# EAGLE design Sensor Acquisition Board Rev4 (EAGLE 9.6.2)
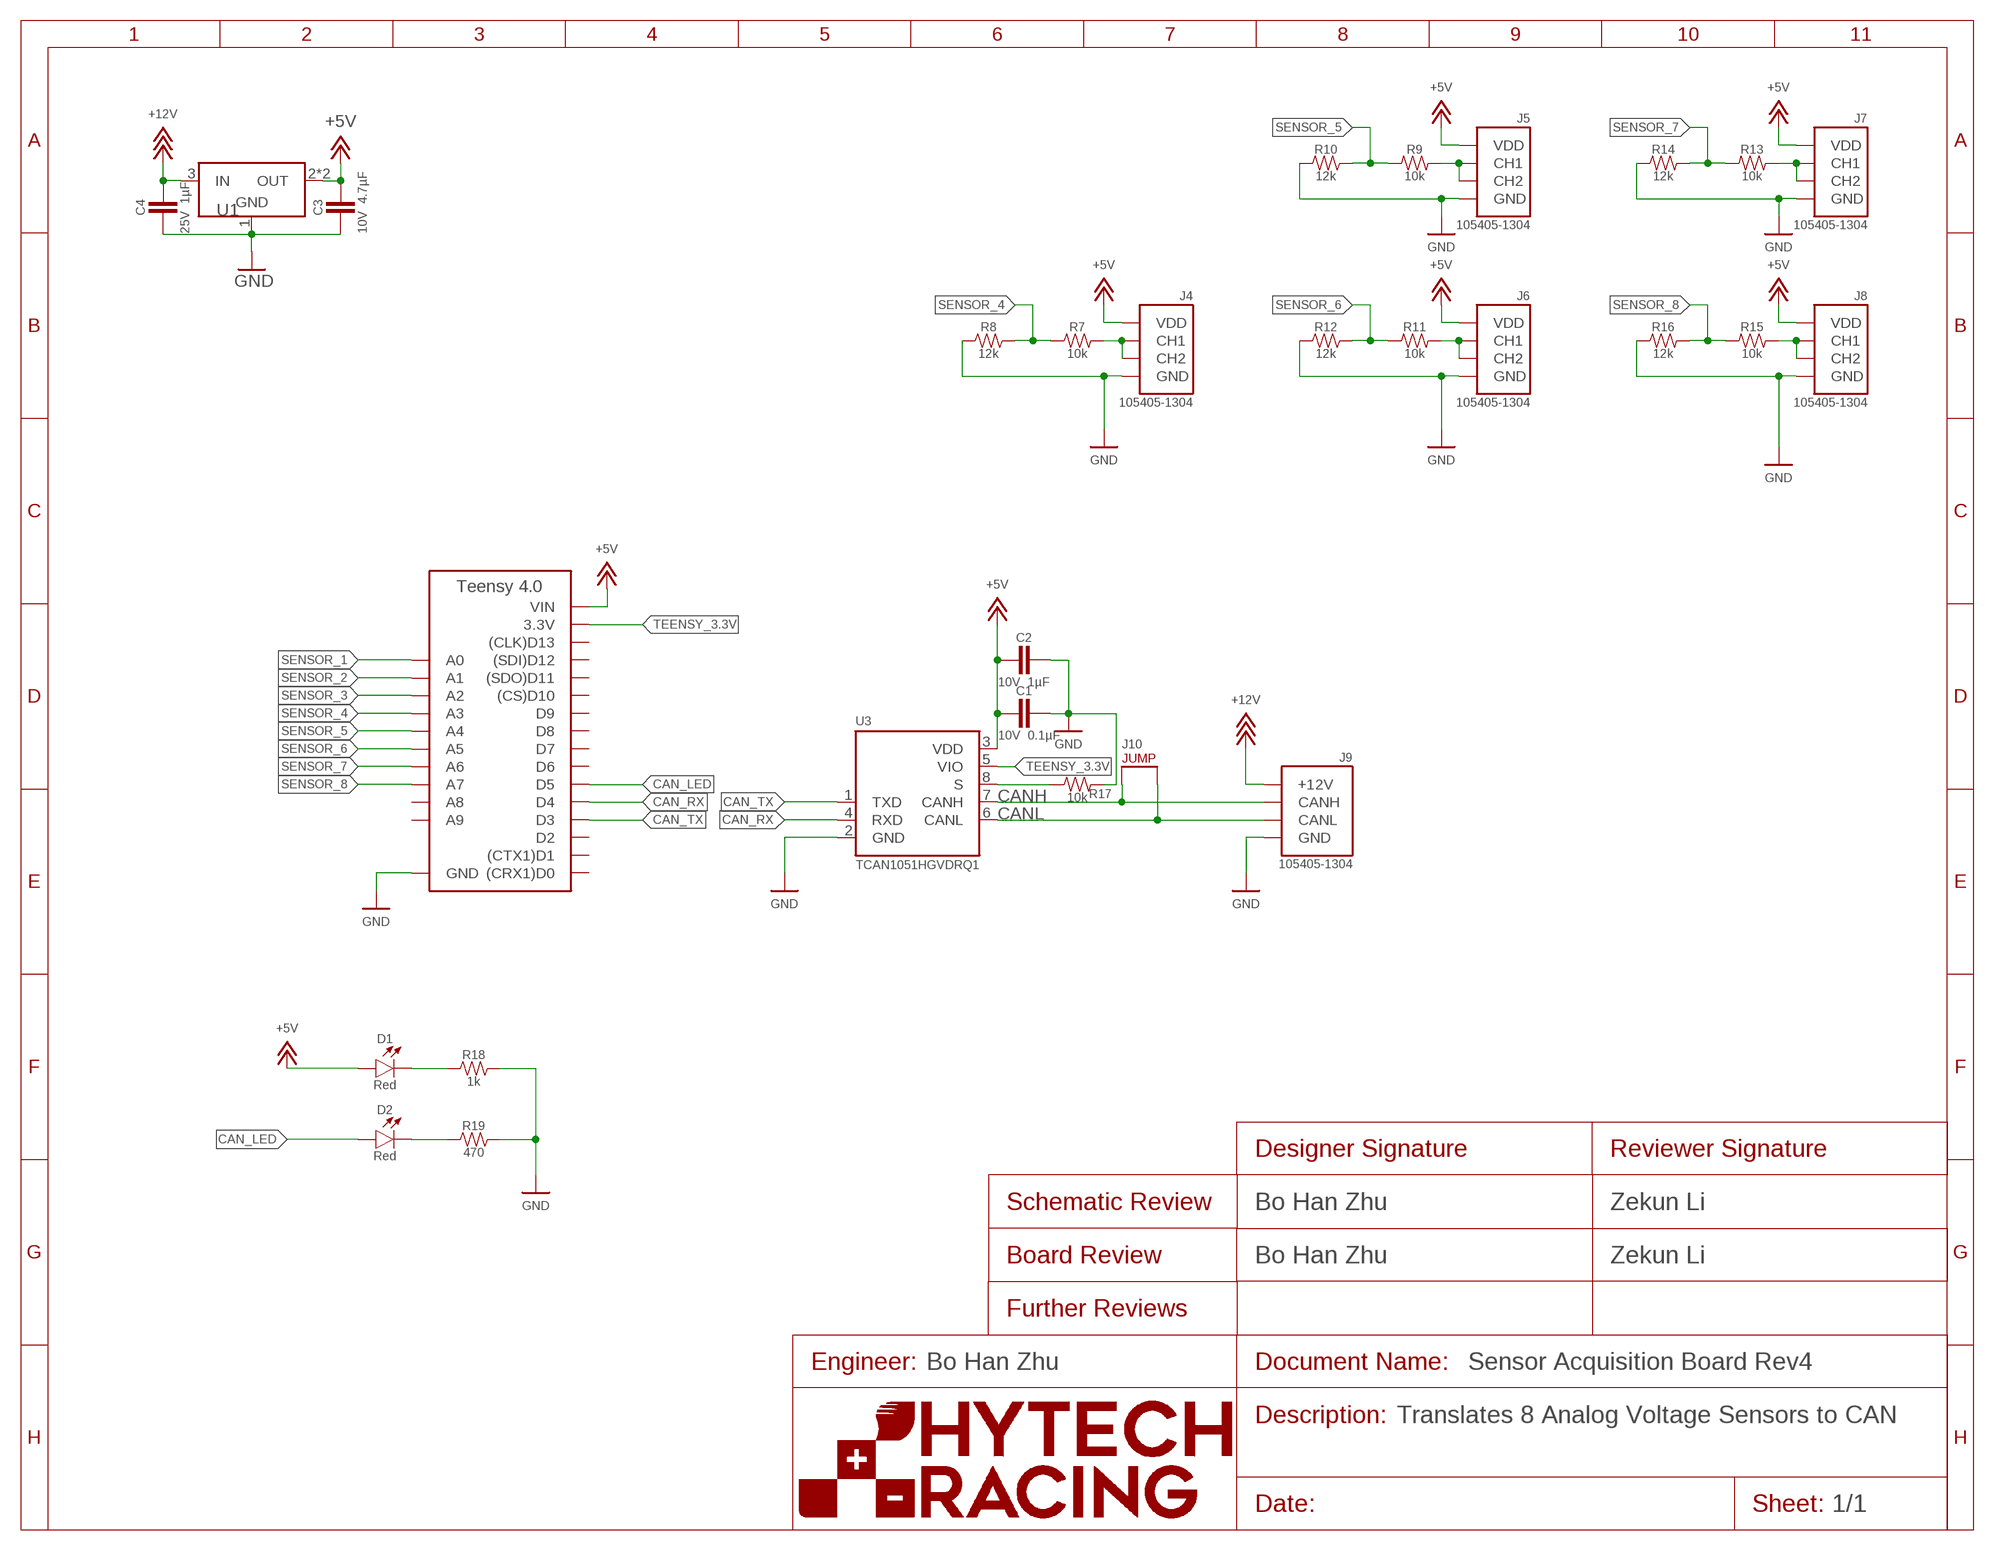
[diagram p0: schematic, sheet 1]
FRAME1 (FRAME): DESCRIPTION_1: Translates 8 Analog Voltage Sensors to CAN; DESIGNER_BOARD: Bo Han Zhu; DESIGNER_SCHEMATIC: Bo Han Zhu; ENGINEER: Bo Han Zhu; REVIEWER_BOARD: Zekun Li; REVIEWER_SCHEMATIC: Zekun Li

## Parts
A2  TEENSY_4.0  [TEENSY_SHORT]
C1  CAPACITOR_0603_10V_0.1UF  [0603-CAP]
C2  CAPACITOR_0603_10V_1UF  [0603-CAP]
C3  CAPACITOR_0603_10V_4.7UF  [0603-CAP]
C4  CAPACITOR_0603_25V_1UF  [0603-CAP]
D1  LED_0603_RED  [0603-LED]
D2  LED_0603_RED  [0603-LED]
J4  CONNECTOR-SENSOR_NF_S_RA_BLACK  [MOLEX_NANOFIT_SMD_RIGHTANGLE_04]
J5  CONNECTOR-SENSOR_NF_S_RA_BLACK  [MOLEX_NANOFIT_SMD_RIGHTANGLE_04]
J6  CONNECTOR-SENSOR_NF_S_RA_BLACK  [MOLEX_NANOFIT_SMD_RIGHTANGLE_04]
J7  CONNECTOR-SENSOR_NF_S_RA_BLACK  [MOLEX_NANOFIT_SMD_RIGHTANGLE_04]
J8  CONNECTOR-SENSOR_NF_S_RA_BLACK  [MOLEX_NANOFIT_SMD_RIGHTANGLE_04]
J9  CONNECTOR-CAN_NF_S_RA_BLACK  [MOLEX_NANOFIT_SMD_RIGHTANGLE_04]
J10  JUMPER_0603_  [0603-RES]
R7  RESISTOR_0603_10K  [0603-RES]
R8  RESISTOR_0603_12K  [0603-RES]
R9  RESISTOR_0603_10K  [0603-RES]
R10  RESISTOR_0603_12K  [0603-RES]
R11  RESISTOR_0603_10K  [0603-RES]
R12  RESISTOR_0603_12K  [0603-RES]
R13  RESISTOR_0603_10K  [0603-RES]
R14  RESISTOR_0603_12K  [0603-RES]
R15  RESISTOR_0603_10K  [0603-RES]
R16  RESISTOR_0603_12K  [0603-RES]
R17  RESISTOR_0603_10K  [0603-RES]
R18  RESISTOR_0603_1K  [0603-RES]
R19  RESISTOR_0603_470  [0603-RES]
U1  VOLTAGE_REGULATOR_SOT-223_5V  [SOT-223]
U3  TCAN1051HQV-Q1  [SOIC-08(NARROW,0.15")]

## Nets
+5V: A2.VIN C1.2 C2.2 C3.1 D1.2(A) J4.1(VDD) J5.1(VDD) J6.1(VDD) J7.1(VDD) J8.1(VDD) U1.2(OUT) U1.4(OUT) U3.3(VDD)
+12V: C4.1 J9.1(+12V) U1.3(IN)
CAN_LED: A2.D5 D2.2(A)
CAN_RX: A2.D4 U3.4(RXD)
CAN_TX: A2.D3 U3.1(TXD)
CANH: J9.4(CANH) J10.1 U3.7(CANH)
CANL: J9.3(CANL) J10.2 U3.6(CANL)
GND: A2.AGND/GND(GND) A2.GND C1.1 C2.1 C3.2 C4.2 J4.2(GND) J5.2(GND) J6.2(GND) J7.2(GND) J8.2(GND) J9.2(GND) R8.1 R10.1 R12.1 R14.1 R16.1 R17.2 R18.2 R19.2 U1.1(GND) U3.2(GND)
N$1: D1.1(C) R18.1
N$2: D2.1(C) R19.1
N$3: J8.3(CH1) J8.4(CH2) R15.2
N$4: R17.1 U3.8(S)
N$5: J7.3(CH1) J7.4(CH2) R13.2
N$6: J5.3(CH1) J5.4(CH2) R9.2
N$7: J6.3(CH1) J6.4(CH2) R11.2
N$9: J4.3(CH1) J4.4(CH2) R7.2
SENSOR_1: A2.D14(A0)
SENSOR_2: A2.D15(A1)
SENSOR_3: A2.D16(A2)
SENSOR_4: A2.D17(A3) R7.1 R8.2
SENSOR_5: A2.D18(A4) R9.1 R10.2
SENSOR_6: A2.D19(A5) R11.1 R12.2
SENSOR_7: A2.D20(A6) R13.1 R14.2
SENSOR_8: A2.D21(A7) R15.1 R16.2
TEENSY_3.3V: A2.3.3V U3.5(VIO)
Unconnected: A2.D0((CRX1)D0) A2.D1((CTX1)D1) A2.D2 A2.D6 A2.D7 A2.D8 A2.D9 A2.D10((CS)D10) A2.D11((SDO)D11) A2.D12((SDI)D12) A2.D13((CLK)D13) A2.D22(A8) A2.D23(A9)

## Library data of the parts
A2 = HyTechDevices:TEENSY_4.0: Teensy 4.0 Datasheet <https://www.pjrc.com/store/teensy40.html> Requires ordering of: 2: 14 pin, 0.1" pitch female headers; TEENSY: 4.0
C1 = HyTechDevices:CAPACITOR_?_*: Capacitor, Non-Polarized VJ...1BC Series Datasheet <https://www.mouser.com/datasheet/2/427/vjw1bcbascomseries-1762447.pdf> Samsung Datasheet <https://www.mouser.com/datasheet/2/585/MLCC-1837944.pdf> Walsin Datasheet <https://www.mouser.com/datasheet/2/210/WTC_MLCC_General_Purpose-1534899.pdf> GRM188R61A226ME15D <https://www.mouser.com/datasheet/2/281/1/GRM188R61A226ME15_02A-1985787.pdf> GRM188R61E106MA73D <https://www.mouser.com/datasheet/2/281/1/GRM188R61E106MA73_01A-1985806.pdf> 885012006013 <https://www.mouser.com/datasheet/2/445/885012006013-1726946.pdf> 2220Y6300105KXTWS2 <https://www.mouser.com/datasheet/2/218/SMD_High_and_Std_StackiCap_P62-1825512.pdf> Yageo Class 2, X5R <https://www.mouser.com/datasheet/2/447/UPY_GPHC_X5R_4V_to_50V_26-1827097.pdf> TDK C Series <https://www.mouser.com/ProductDetail/TDK/C3216X5R1V226M160AC?qs=%2Fha2pyFadujbcx9jh7lYl%2F4NeMoXFhdc8AqVWNq4wW6M2y7zl6GzBuhgtI0ngznN> AVX Automotive MLCC <https://www.mouser.com/datasheet/2/40/AutoMLCC-777028.pdf> KEMET X7R Series <https://www.mouser.com/datasheet/2/212/KEM_C1002_X7R_SMD-1102033.pdf> Kyocera AVX <https://www.mouser.com/datasheet/2/40/C0GNP0_Dielectric-951274.pdf>; CAPACITANCE: 0.1µF; DKPN: 720-1688-1-ND; MANUFACTURER: Vishay Vitramon; MOPN: 77-VJ0603Y104JXQPBC; MPN: VJ0603Y104JXQPW1BC; TOLERANCE: 5%; VOLTAGE: 10V
C2 = HyTechDevices:CAPACITOR_?_*: Capacitor, Non-Polarized VJ...1BC Series Datasheet <https://www.mouser.com/datasheet/2/427/vjw1bcbascomseries-1762447.pdf> Samsung Datasheet <https://www.mouser.com/datasheet/2/585/MLCC-1837944.pdf> Walsin Datasheet <https://www.mouser.com/datasheet/2/210/WTC_MLCC_General_Purpose-1534899.pdf> GRM188R61A226ME15D <https://www.mouser.com/datasheet/2/281/1/GRM188R61A226ME15_02A-1985787.pdf> GRM188R61E106MA73D <https://www.mouser.com/datasheet/2/281/1/GRM188R61E106MA73_01A-1985806.pdf> 885012006013 <https://www.mouser.com/datasheet/2/445/885012006013-1726946.pdf> 2220Y6300105KXTWS2 <https://www.mouser.com/datasheet/2/218/SMD_High_and_Std_StackiCap_P62-1825512.pdf> Yageo Class 2, X5R <https://www.mouser.com/datasheet/2/447/UPY_GPHC_X5R_4V_to_50V_26-1827097.pdf> TDK C Series <https://www.mouser.com/ProductDetail/TDK/C3216X5R1V226M160AC?qs=%2Fha2pyFadujbcx9jh7lYl%2F4NeMoXFhdc8AqVWNq4wW6M2y7zl6GzBuhgtI0ngznN> AVX Automotive MLCC <https://www.mouser.com/datasheet/2/40/AutoMLCC-777028.pdf> KEMET X7R Series <https://www.mouser.com/datasheet/2/212/KEM_C1002_X7R_SMD-1102033.pdf> Kyocera AVX <https://www.mouser.com/datasheet/2/40/C0GNP0_Dielectric-951274.pdf>; CAPACITANCE: 1µF; DKPN: 311-1796-1-ND; MANUFACTURER: Yageo; MOPN: 603-CC603KRX7R6BB105; MPN: CC0603KRX7R6BB105; TOLERANCE: 10%; VOLTAGE: 10V
C3 = HyTechDevices:CAPACITOR_?_*: Capacitor, Non-Polarized VJ...1BC Series Datasheet <https://www.mouser.com/datasheet/2/427/vjw1bcbascomseries-1762447.pdf> Samsung Datasheet <https://www.mouser.com/datasheet/2/585/MLCC-1837944.pdf> Walsin Datasheet <https://www.mouser.com/datasheet/2/210/WTC_MLCC_General_Purpose-1534899.pdf> GRM188R61A226ME15D <https://www.mouser.com/datasheet/2/281/1/GRM188R61A226ME15_02A-1985787.pdf> GRM188R61E106MA73D <https://www.mouser.com/datasheet/2/281/1/GRM188R61E106MA73_01A-1985806.pdf> 885012006013 <https://www.mouser.com/datasheet/2/445/885012006013-1726946.pdf> 2220Y6300105KXTWS2 <https://www.mouser.com/datasheet/2/218/SMD_High_and_Std_StackiCap_P62-1825512.pdf> Yageo Class 2, X5R <https://www.mouser.com/datasheet/2/447/UPY_GPHC_X5R_4V_to_50V_26-1827097.pdf> TDK C Series <https://www.mouser.com/ProductDetail/TDK/C3216X5R1V226M160AC?qs=%2Fha2pyFadujbcx9jh7lYl%2F4NeMoXFhdc8AqVWNq4wW6M2y7zl6GzBuhgtI0ngznN> AVX Automotive MLCC <https://www.mouser.com/datasheet/2/40/AutoMLCC-777028.pdf> KEMET X7R Series <https://www.mouser.com/datasheet/2/212/KEM_C1002_X7R_SMD-1102033.pdf> Kyocera AVX <https://www.mouser.com/datasheet/2/40/C0GNP0_Dielectric-951274.pdf>; CAPACITANCE: 4.7µF; DKPN: 1276-1044-1-ND; MANUFACTURER: Samsung Electro-Mechanics; MOPN: 187-CL10A475KP8NNNC; MPN: CL10A475KP8NNNC; TOLERANCE: 10%; VOLTAGE: 10V
C4 = HyTechDevices:CAPACITOR_?_*: Capacitor, Non-Polarized VJ...1BC Series Datasheet <https://www.mouser.com/datasheet/2/427/vjw1bcbascomseries-1762447.pdf> Samsung Datasheet <https://www.mouser.com/datasheet/2/585/MLCC-1837944.pdf> Walsin Datasheet <https://www.mouser.com/datasheet/2/210/WTC_MLCC_General_Purpose-1534899.pdf> GRM188R61A226ME15D <https://www.mouser.com/datasheet/2/281/1/GRM188R61A226ME15_02A-1985787.pdf> GRM188R61E106MA73D <https://www.mouser.com/datasheet/2/281/1/GRM188R61E106MA73_01A-1985806.pdf> 885012006013 <https://www.mouser.com/datasheet/2/445/885012006013-1726946.pdf> 2220Y6300105KXTWS2 <https://www.mouser.com/datasheet/2/218/SMD_High_and_Std_StackiCap_P62-1825512.pdf> Yageo Class 2, X5R <https://www.mouser.com/datasheet/2/447/UPY_GPHC_X5R_4V_to_50V_26-1827097.pdf> TDK C Series <https://www.mouser.com/ProductDetail/TDK/C3216X5R1V226M160AC?qs=%2Fha2pyFadujbcx9jh7lYl%2F4NeMoXFhdc8AqVWNq4wW6M2y7zl6GzBuhgtI0ngznN> AVX Automotive MLCC <https://www.mouser.com/datasheet/2/40/AutoMLCC-777028.pdf> KEMET X7R Series <https://www.mouser.com/datasheet/2/212/KEM_C1002_X7R_SMD-1102033.pdf> Kyocera AVX <https://www.mouser.com/datasheet/2/40/C0GNP0_Dielectric-951274.pdf>; CAPACITANCE: 1µF; DKPN: 1276-1184-1-ND; MANUFACTURER: Samsung Electro-Mechanics; MOPN: 187-CL10B105KA8NNNC; MPN: CL10B105KA8NNNC; TOLERANCE: 10%; VOLTAGE: 25V
D1 D2 = HyTechDevices:LED_?_*: LED 0603 Blue <https://www.mouser.com/datasheet/2/216/APT1608VBC_D-246010.pdf> Green <https://www.mouser.com/datasheet/2/216/APT1608ZGCK-1173388.pdf> Orange <https://www.mouser.com/datasheet/2/216/APT1608SECK-6197.pdf> Red <https://www.mouser.com/datasheet/2/216/APT1608SECK-J3-PRV-1173336.pdf> White <https://www.mouser.com/datasheet/2/50/SM0603UWC-880813.pdf> Yellow <https://www.mouser.com/datasheet/2/216/APT1608SYCK-J3-PRV-1173311.pdf> 2835 (Series not on Digikey) Lumiled LUXEON 2835 Color Line <https://www.mouser.com/datasheet/2/602/DS236_luxeon_2835_color_line_datasheet-1596094.pdf>; COLOR: Red; DKPN: 754-1786-1-ND; MANUFACTURER: Kingbright; MOPN: 604-APT1608SECKJ3PRV; MPN: APT1608SECK/J3-PRV
J4-J8 = HyTechDevices:CONNECTOR-SENSOR_?_*: HyTech Sensor Connector; DKPN: 1054051304-ND; MANUFACTURER: Molex; MOPN: 538-105405-1304; MPN: 105405-1304
J9 = HyTechDevices:CONNECTOR-CAN_?_*: HyTech CAN Connector; DKPN: 1054051304-ND; MANUFACTURER: Molex; MOPN: 538-105405-1304; MPN: 105405-1304
J10 = HyTechDevices:JUMPER_?_*: 2 Pin Connector; DKPN: 13-RC0603FR-130RLTR-ND; MANUFACTURER: YAGEO; MOPN: 603-RC0603FR-130RL; MPN: RC0603FR-130RL
R7 R9 R11 R13 R15 R17 = HyTechDevices:RESISTOR_?_*: Resistor PWR163 Series <https://www.mouser.com/datasheet/2/54/pwr163-777985.pdf> AC Series <https://www.mouser.com/datasheet/2/447/Yageo_PYu_AC_51_RoHS_L_7_1714230-1874691.pdf> PU Series <https://www.mouser.com/datasheet/2/447/PYu-PU_51_RoHS_L_6-1504619.pdf> ERA Series <https://www.mouser.com/datasheet/2/315/AOA0000C307-1149632.pdf> PWR263 Series <https://www.mouser.com/datasheet/2/54/pwr263s_35-778069.pdf> RC Series <https://www.mouser.com/datasheet/2/447/Yageo_03_18_2021_PYu_RC_Group_51_RoHS_L_11-2199992.pdf> ERJ PB3, PB6 Series <https://www.mouser.com/datasheet/2/315/AOA0000C328-1530132.pdf> ERJ PA2, P03, PA3, P06, P08, P14 Series <https://www.mouser.com/datasheet/2/315/AOA0000C331-1141874.pdf>; DKPN: 311-10.0KHRCT-ND; MANUFACTURER: Yageo; MOPN: 603-RC0603FR-0710KL; MPN: RC0603FR-0710KL; POWER: 0.1W; RESISTANCE: 10k; TOLERANCE: 1%; VOLTAGE_CONTINUOUS: 31.62V; VOLTAGE_MAX: 75V
R8 R10 R12 R14 R16 = HyTechDevices:RESISTOR_?_*: Resistor PWR163 Series <https://www.mouser.com/datasheet/2/54/pwr163-777985.pdf> AC Series <https://www.mouser.com/datasheet/2/447/Yageo_PYu_AC_51_RoHS_L_7_1714230-1874691.pdf> PU Series <https://www.mouser.com/datasheet/2/447/PYu-PU_51_RoHS_L_6-1504619.pdf> ERA Series <https://www.mouser.com/datasheet/2/315/AOA0000C307-1149632.pdf> PWR263 Series <https://www.mouser.com/datasheet/2/54/pwr263s_35-778069.pdf> RC Series <https://www.mouser.com/datasheet/2/447/Yageo_03_18_2021_PYu_RC_Group_51_RoHS_L_11-2199992.pdf> ERJ PB3, PB6 Series <https://www.mouser.com/datasheet/2/315/AOA0000C328-1530132.pdf> ERJ PA2, P03, PA3, P06, P08, P14 Series <https://www.mouser.com/datasheet/2/315/AOA0000C331-1141874.pdf>; DKPN: 311-12.0KHRCT-ND; MANUFACTURER: Yageo; MOPN: 603-RC0603FR-0712KL; MPN: RC0603FR-0712KL; POWER: 0.1W; RESISTANCE: 12k; TOLERANCE: 1%; VOLTAGE_CONTINUOUS: 34.64V; VOLTAGE_MAX: 75V
R18 = HyTechDevices:RESISTOR_?_*: Resistor PWR163 Series <https://www.mouser.com/datasheet/2/54/pwr163-777985.pdf> AC Series <https://www.mouser.com/datasheet/2/447/Yageo_PYu_AC_51_RoHS_L_7_1714230-1874691.pdf> PU Series <https://www.mouser.com/datasheet/2/447/PYu-PU_51_RoHS_L_6-1504619.pdf> ERA Series <https://www.mouser.com/datasheet/2/315/AOA0000C307-1149632.pdf> PWR263 Series <https://www.mouser.com/datasheet/2/54/pwr263s_35-778069.pdf> RC Series <https://www.mouser.com/datasheet/2/447/Yageo_03_18_2021_PYu_RC_Group_51_RoHS_L_11-2199992.pdf> ERJ PB3, PB6 Series <https://www.mouser.com/datasheet/2/315/AOA0000C328-1530132.pdf> ERJ PA2, P03, PA3, P06, P08, P14 Series <https://www.mouser.com/datasheet/2/315/AOA0000C331-1141874.pdf>; DKPN: 311-1.00KHRCT-ND; MANUFACTURER: Yageo; MOPN: 603-RC0603FR-071KL; MPN: RC0603FR-071KL; POWER: 0.1W; RESISTANCE: 1k; TOLERANCE: 1%; VOLTAGE_CONTINUOUS: 10.00V; VOLTAGE_MAX: 75V
R19 = HyTechDevices:RESISTOR_?_*: Resistor PWR163 Series <https://www.mouser.com/datasheet/2/54/pwr163-777985.pdf> AC Series <https://www.mouser.com/datasheet/2/447/Yageo_PYu_AC_51_RoHS_L_7_1714230-1874691.pdf> PU Series <https://www.mouser.com/datasheet/2/447/PYu-PU_51_RoHS_L_6-1504619.pdf> ERA Series <https://www.mouser.com/datasheet/2/315/AOA0000C307-1149632.pdf> PWR263 Series <https://www.mouser.com/datasheet/2/54/pwr263s_35-778069.pdf> RC Series <https://www.mouser.com/datasheet/2/447/Yageo_03_18_2021_PYu_RC_Group_51_RoHS_L_11-2199992.pdf> ERJ PB3, PB6 Series <https://www.mouser.com/datasheet/2/315/AOA0000C328-1530132.pdf> ERJ PA2, P03, PA3, P06, P08, P14 Series <https://www.mouser.com/datasheet/2/315/AOA0000C331-1141874.pdf>; DKPN: P470BYCT-ND; MANUFACTURER: Panasonic Electronic Components; MOPN: 667-ERJ-PA3F4700V; MPN: ERJ-PA3F4700V; POWER: 0.25W; RESISTANCE: 470; TOLERANCE: 1%; VOLTAGE_CONTINUOUS: 10.84V; VOLTAGE_MAX: 150V
U1 = HyTechDevices:VOLTAGE_REGULATOR_?_*: Voltage Regulators LDL1117S50R Datasheet <https://www.mouser.com/datasheet/2/389/dm00366442-1799212.pdf> NCP785AH120T1G <https://www.mouser.com/datasheet/2/308/NCP785A_D-1812704.pdf> LMS8117A Datasheet <https://www.ti.com/lit/ds/symlink/lms8117a.pdf?HQS>; DKPN: 497-17240-1-ND; MANUFACTURER: STMicroelectronics; MOPN: 511-LDL1117S50R; MPN: LDL1117S50R
U3 = HyTechDevices:TCAN1051*V-Q1: TCAN1051*V Can Tranciever Datasheet <https://www.ti.com/lit/ds/symlink/tcan1051hgv-q1.pdf?HQS=dis-mous-null-mousermode-dsf-pf-null-wwe&ts=1610765132518&ref_url=https%253A%252F%252Fwww.mouser.com%252Ff>; DKPN: 296-49935-1-ND; MANUFACTURER: Texas Instruments; MOPN: 595-TCAN1051HGVDQ1; MPN: TCAN1051HGVDRQ1

## Board
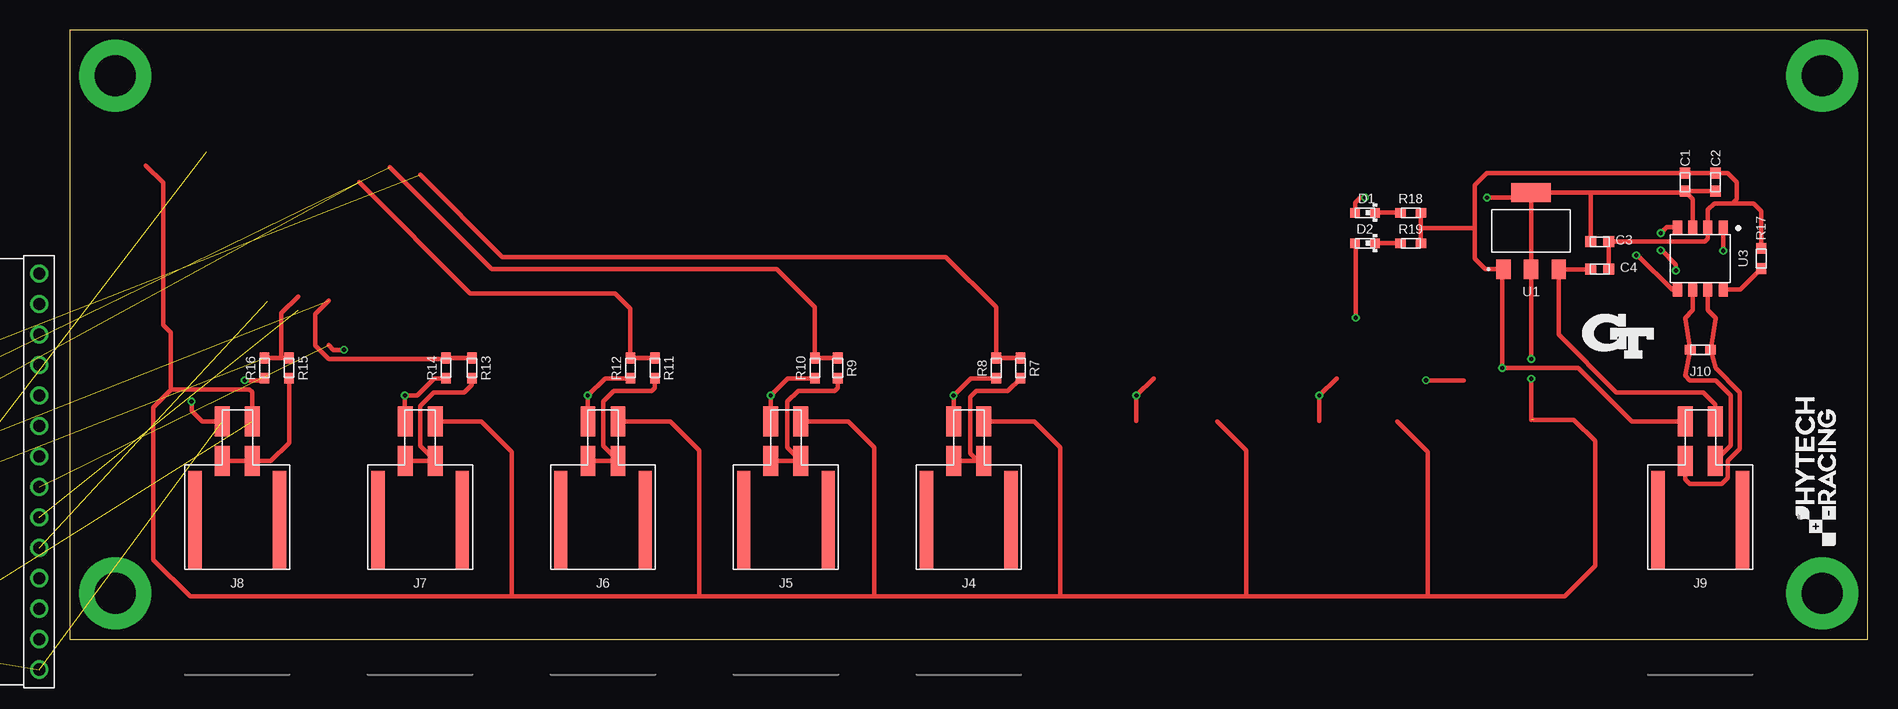
[diagram p1: board, top side]
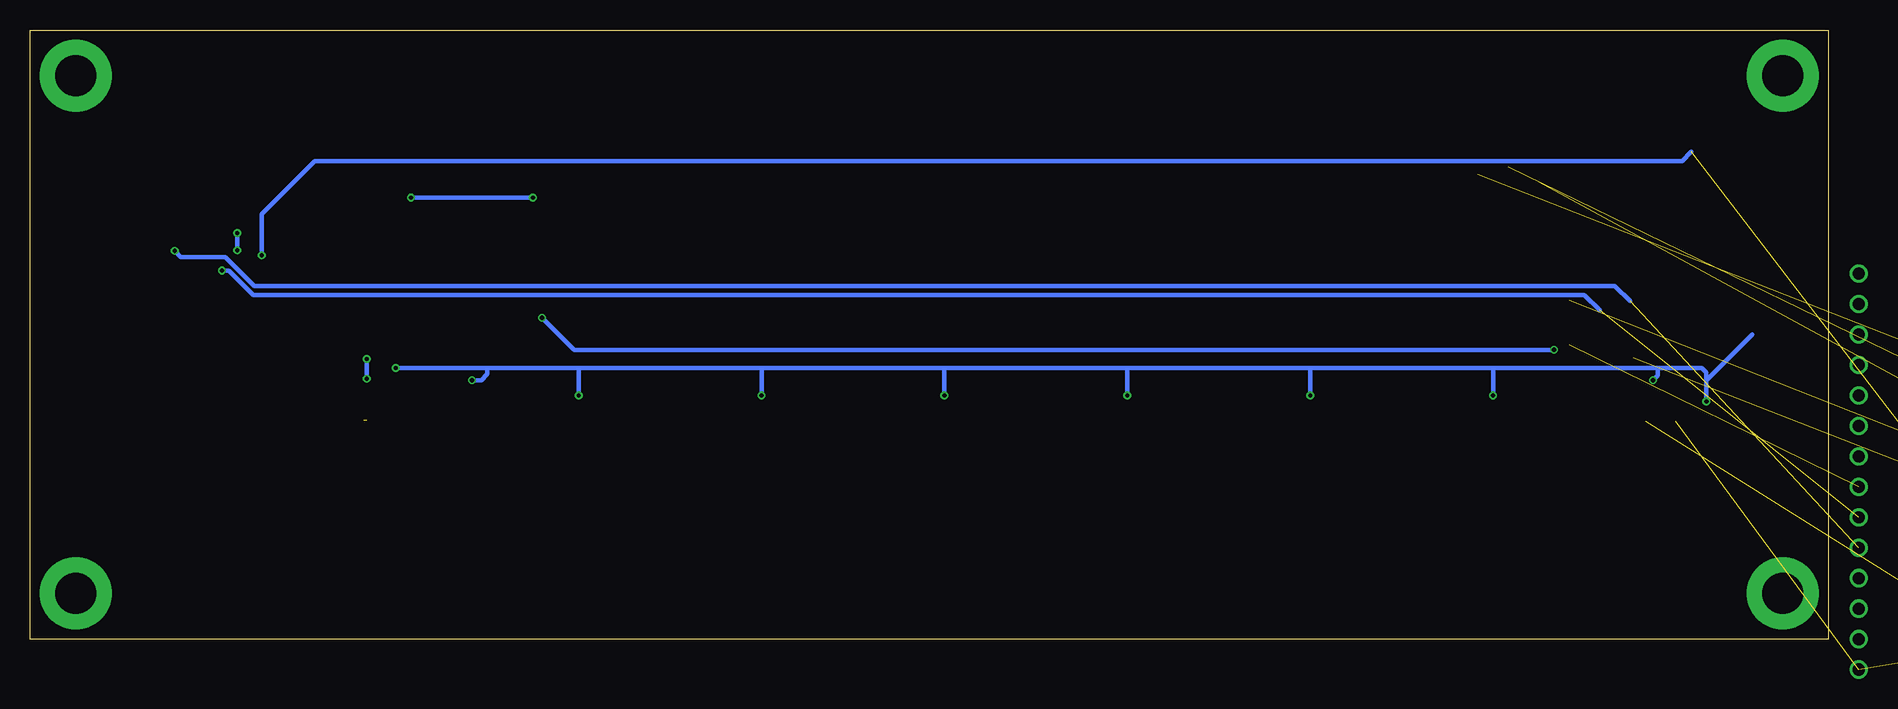
[diagram p2: board, bottom side, seen from below]

Size 149.86 x 50.8 mm. Coordinates in mm from the lower left corner, seen from the top.
Outline: 0,0 149.86,0 149.86,50.8 0,50.8 0,0
Copper layers (1*16): Top 0.035mm / dielectric 1.53mm / Bottom 0.035mm
Design rules "JLCPCB (2 Layer)": minimum track width 5mil, minimum drill 0.3mm, track to track 5mil, track to pad 5mil, pad to pad 5mil, via to via 20mil, smd to smd 5mil, copper to edge 0.2mm, drill to drill 21mil, minimum pad ring 6mil, minimum via ring 6mil, stop-mask expansion 6mil, vias tented up to drill 30mil, thermal gap 10mil

### Footprints (pad centres in the part's own frame; a part is rotated, then mirrored left to right if it is on the bottom)
TEENSY_SHORT = drill 1.016: 3.3V 0,5.08; AGND/GND 0,2.54; D0 15.24,2.54; D1 15.24,5.08; D2 15.24,7.62; D3 15.24,10.16; D4 15.24,12.7; D5 15.24,15.24; D6 15.24,17.78; D7 15.24,20.32; D8 15.24,22.86; D9 15.24,25.4; D10 15.24,27.94; D11 15.24,30.48; D12 15.24,33.02; D13 0,33.02; D14 0,30.48; D15 0,27.94; D16 0,25.4; D17 0,22.86; D18 0,20.32; D19 0,17.78; D20 0,15.24; D21 0,12.7; D22 0,10.16; D23 0,7.62; GND 15.24,0; VIN 0,0
0603-CAP = smd 0.9 x 0.9: 1 -0.75,0; 2 0.75,0
0603-LED = smd 0.8 x 0.8: 1 -0.825,0; 2 0.825,0
MOLEX_NANOFIT_SMD_RIGHTANGLE_04 = smd 1.24 x 2.5: 1 1.25,1.65; 2 -1.25,1.65; 3 1.25,-1.65; 4 -1.25,-1.65 | smd 1.1 x 8.2: PAD1 -3.52,-6.58; PAD2 3.52,-6.58
0603-RES = smd 0.9 x 0.8: 1 -0.85,0; 2 0.85,0
SOT-223 = smd 1.2 x 1.6: 1 -2.3,-3.2; 2 0,-3.2; 3 2.3,-3.2 | smd 3.3 x 1.6: 4 0,3.2
SOIC-08(NARROW,0.15") = smd 0.762 x 1.143: 1 -1.905,-2.603; 2 -0.635,-2.603; 3 0.635,-2.603; 4 1.905,-2.603; 5 1.905,2.603; 6 0.635,2.603; 7 -0.635,2.603; 8 -1.905,2.603
MOUNTING_M3 = drill 3.4 pad 6: 1 0,0

### Placement (x,y rotation side)
A2  -17.78,-2.54 0 top
C1  134.62,38.1 270 top
C2  137.16,38.1 270 top
C3  127.51,33.15 0 top
C4  127.51,30.86 0 top
D1  107.95,35.56 180 top
D2  107.95,33.02 180 top
J4  74.93,16.51 0 top
J5  59.69,16.51 0 top
J6  44.45,16.51 0 top
J7  29.21,16.51 0 top
J8  13.97,16.51 0 top
J9  135.89,16.51 0 top
J10  135.89,24.13 180 top
R7  79.25,22.61 270 top
R8  77.22,22.61 90 top
R9  64.01,22.61 270 top
R10  62.1,22.61 90 top
R11  48.77,22.61 270 top
R12  46.74,22.61 90 top
R13  33.53,22.61 270 top
R14  31.37,22.61 90 top
R15  18.29,22.61 270 top
R16  16.26,22.61 90 top
R17  140.97,31.75 90 top
R18  111.76,35.56 0 top
R19  111.76,33.02 0 top
U1  121.79,34.04 0 top
U3  135.89,31.75 180 top
U$1  [MOUNTING_M3]  146.05,3.81 0 top
U$2  [MOUNTING_M3]  3.81,3.81 0 top
U$3  [LOGO_HYTECH_0.5"]  147.32,7.62 90 top
U$4  [MOUNTING_M3]  146.05,46.99 0 top
U$5  [MOUNTING_M3]  3.81,46.99 0 top
U$6  [LOGO_GT_0.25"]  129.03,25.27 0 top

### Tracks (layer width: path | path; a pad name or v marks a point on that pad's centre or on a via)
+5V  (via drill 0.35)  (2 unrouted)
  Top 0.381: C1.2 C2.2 | C1.2 135.25,36.72 U3.3 | J8.1 15.22,20.59 14.99,20.83 8.51,20.83 8.45,20.77 | 36.83,3.56 10.03,3.56 6.99,6.6 6.99,19.3 8.45,20.77 | 36.83,3.56 52.45,3.56 | 52.45,3.56 67.06,3.56 | 67.06,3.56 82.55,3.56 | 82.55,3.56 98.04,3.56 | 98.04,3.56 113.16,3.56 | 113.16,3.56 124.59,3.56 127.13,6.1 127.13,16.51 125.35,18.29 122.03,18.29 | 113.16,3.56 113.16,15.62 110.62,18.16 | 98.04,3.56 98.04,15.75 95.63,18.16 | J4.1 80.39,18.16 82.55,16 82.55,3.56 | J5.1 64.9,18.16 67.06,16 67.06,3.56 | J6.1 50.04,18.16 52.45,15.75 52.45,3.56 | J7.1 34.29,18.16 36.83,15.62 36.83,3.56 | 8.45,20.77 8.45,25.55 7.79,26.21 7.79,38.06 6.35,39.5 | U1.4 126.75,37.24 | 126.75,37.24 134.51,37.24 C1.2 | U1.4 U1.2 v121.79,23.37 | v121.79,21.72 121.79,18.27 | C3.1 126.76,37.22 126.75,37.24 | U1.4 121.39,36.83 v118.11,36.83 | v107.95,36.83 107.57,36.83 107.12,36.39 D1.2
  Bottom 0.381: v121.79,23.37 v121.79,21.72 | v118.11,36.83 v107.95,36.83
+12V
  Top 0.381: J9.1 137.14,19.58 136.14,20.57 128.91,20.57 124.09,25.39 U1.3 126.73,30.84 C4.1
CAN_LED  (via drill 0.35)  (1 unrouted)
  Top 0.381: v107.19,26.8 107.19,32.96 D2.2 | v22.86,24.13 21.97,24.13 21.59,24.51
  Bottom 0.381: v107.19,26.8 104.52,24.13 v22.86,24.13
CAN_RX  (via drill 0.35)  (1 unrouted)
  Top 0.381: v133.86,30.73 133.86,31.24 132.59,32.51 v132.59,32.43 | v132.59,33.87 133.07,34.35 U3.4
  Bottom 0.381: v133.86,30.73 133.31,30.73 131.27,28.7 20.32,28.7 19.05,27.43 | v132.59,32.43 v132.59,33.87
CAN_TX  (via drill 0.35)  (1 unrouted)
  Top 0.381: U3.1 v137.79,32.38
  Bottom 0.381: 16.51,28.19 17.78,29.46 131.19,29.46 133.6,31.88 136.27,31.88 137.29,31.88 v137.79,32.38
CANH
  Top 0.381: J9.4 134.64,13.31 135,12.95 137.67,12.95 138.18,13.46 138.18,14.86 139.19,15.88 139.19,20.57 137.16,22.61 J10.1 137.16,26.8 136.53,27.43 U3.7
CANL
  Top 0.381: J9.3 138.43,16.15 138.43,20.32 137.16,21.59 135,21.59 134.62,21.97 J10.2 134.62,26.8 135.25,27.43 U3.6
GND  (via drill 0.35)  (2 unrouted)
  Top 0.381: 138.56,36.32 137.03,36.32 136.53,35.81 U3.2 136.53,33.4 136.27,33.15 C3.2 C4.2 | 138.56,36.32 138.94,36.7 138.94,38.1 138.19,38.85 C2.1 C1.1 118.1,38.85 117.09,37.85 117.09,34.29 | 138.56,36.32 140.34,36.32 140.97,35.69 R17.2 | J8.2 11.05,18.16 10.16,19.05 v10.16,19.81 | 104.14,18.18 v104.14,20.32 105.58,21.76 | J7.2 27.94,18.18 v27.94,20.32 28.96,20.32 30.39,21.76 R14.1 | J6.2 43.18,18.18 v43.18,20.32 44.62,21.76 R12.1 | J5.2 58.42,18.18 v58.42,20.32 59.86,21.76 R10.1 | J4.2 73.66,18.18 v73.66,20.32 75.1,21.76 R8.1 | 88.9,18.18 v88.9,20.32 90.34,21.76 | v119.38,22.61 125.73,22.61 130.18,18.16 J9.2 | v119.38,22.61 119.38,30.72 U1.1 119.47,30.86 117.98,30.86 117.09,31.75 117.09,34.29 | R18.2 112.61,34.29 | 112.61,34.29 R19.2 | 112.61,34.29 117.09,34.29 | v119.38,22.61 119.4,22.59 v119.38,22.61 | R16.1 16.09,21.59 v14.61,21.59 | 116.17,21.59 v113.03,21.59
  Bottom 0.381: 14.22,22.61 10.54,22.61 10.16,22.23 10.16,21.59 | 14.22,22.61 27.94,22.61 | 27.94,22.61 31.75,22.61 43.18,22.61 | 43.18,22.61 58.42,22.61 | 58.42,22.61 73.66,22.61 | 73.66,22.61 88.9,22.61 | 88.9,22.61 104.14,22.61 | v10.16,19.81 10.16,21.59 | v104.14,20.32 104.14,22.61 | v27.94,20.32 27.94,22.61 | v43.18,20.32 43.18,22.35 43.18,22.61 | v58.42,20.32 58.42,22.35 58.42,22.61 | v73.66,20.32 73.66,22.61 | v88.9,20.32 88.9,22.61 | 104.14,22.61 111.76,22.61 | 111.76,22.61 v119.38,22.61 | 10.16,21.59 6.35,25.4 | v14.61,21.59 14.22,21.97 14.22,22.61 | v113.03,21.59 112.27,21.59 111.76,22.1 111.76,22.61
N$1
  Top 0.381: D1.1 R18.1
N$2
  Top 0.381: D2.1 R19.1
N$3
  Top 0.381: J8.4 J8.3 16.77,14.86 18.29,16.38 R15.2
N$4
  Top 0.381: U3.8 139.22,29.15 R17.1
N$5
  Top 0.381: J7.4 29.21,14.86 J7.3 29.21,16.11 29.21,19.43 30.35,20.57 32.89,20.57 33.53,21.21 R13.2
N$6
  Top 0.381: R9.2 64.01,20.95 63.75,20.7 60.71,20.7 59.82,19.81 59.82,15.98 J5.3 J5.4
N$7
  Top 0.381: R11.2 48.77,20.95 48.51,20.7 45.34,20.7 44.45,19.81 44.45,16.11 J6.3 J6.4
N$9
  Top 0.381: R7.2 78.19,20.7 75.56,20.7 75.06,20.19 75.06,15.49 75.69,14.86 J4.3 J4.4
SENSOR_4  (1 unrouted)
  Top 0.381: 29.21,38.73 36.07,31.88 73.03,31.88 77.22,27.69 R8.2 R7.1
SENSOR_5  (1 unrouted)
  Top 0.381: 26.67,39.37 35.18,30.86 58.93,30.86 62.1,27.69 R10.2 R9.1
SENSOR_6  (1 unrouted)
  Top 0.381: R11.1 R12.2 46.74,27.56 45.47,28.83 33.4,28.83 24.13,38.1
SENSOR_7  (1 unrouted)
  Top 0.381: 21.59,28.23 20.48,27.13 20.48,24.47 21.59,23.37 31.28,23.37 R14.2 R13.1
SENSOR_8  (1 unrouted)
  Top 0.381: 19.05,28.57 17.65,27.18 17.65,23.58 17.78,23.46 | R16.2 17.78,23.46 | 17.78,23.46 R15.1
TEENSY_3.3V  (via drill 0.35)  (1 unrouted)
  Top 0.381: U3.5 133.54,29.15 130.68,32.01 v130.55,32.01
  Bottom 0.381: v130.55,32.01 130.55,35.44 126.11,39.88 12.19,39.88 11.43,40.64

### Text on the board
tDocu: 5V | CAN | HyTech Racing 2022 / Sensor Acquisition Board rev4 / Designed by Bo Han Zhu | 8. Motor Cooling Loop Fluid Temp | 7. Ambient Air Temp | 6. B-R Suspension Linear Pot | 5. B-L Suspension Linear Pot | 4. Ambient Air Humidity | 3. Steering Wheel Sensor | 2. F-R Suspension Linear Pot | 1. F-L Suspension Linear Pot | Vehicle CAN-Bus